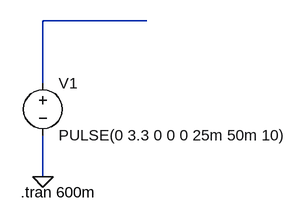
[diagram p0: schematic Draft3.asc]
Draft3.asc, the LTspice schematic file:
Version 4
SHEET 1 880 680
WIRE 208 48 48 48
WIRE 48 144 48 48
WIRE 48 288 48 224
FLAG 48 288 0
SYMBOL voltage 48 128 R0
WINDOW 123 0 0 Left 0
WINDOW 39 0 0 Left 0
SYMATTR InstName V1
SYMATTR Value PULSE(0 3.3 0 0 0 25m 50m 10)
TEXT 14 312 Left 2 !.tran 600m

The netlist it stands for:
* Draft3.asc
V1 N001 0 PULSE(0 3.3 0 0 0 25m 50m 10)
.tran 600m
.backanno
.end